# EAGLE schematic drive-sys-board (EAGLE 6.5.0)
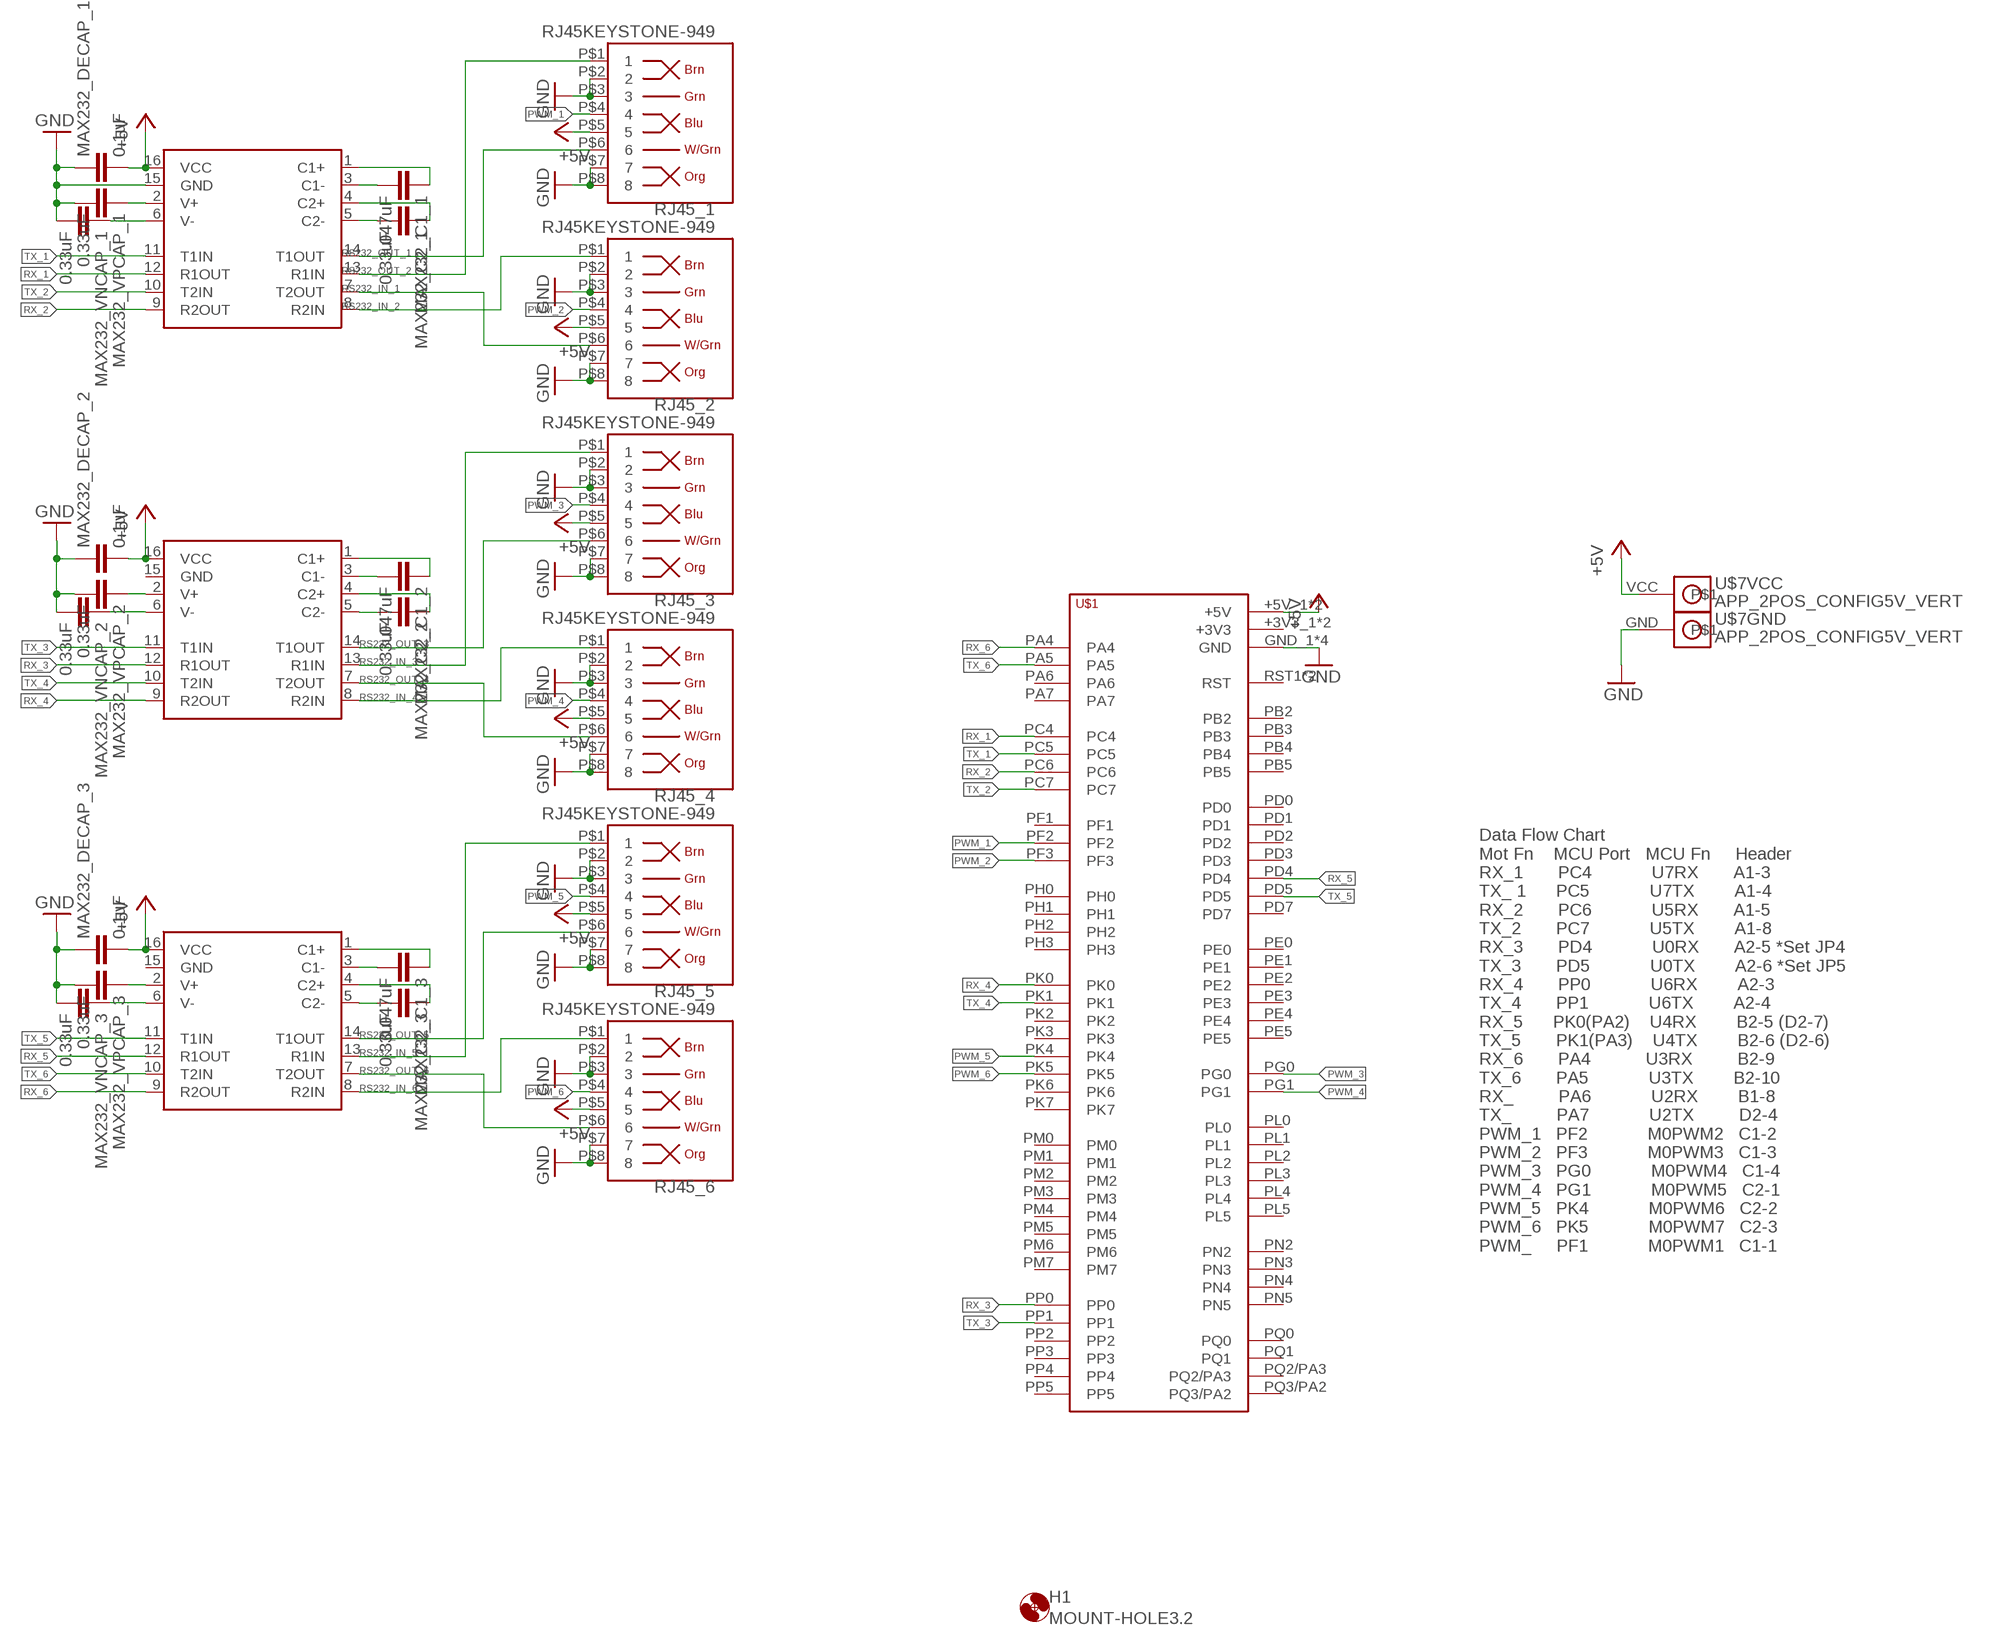
[diagram p0: schematic, sheet 1]

## Parts
H1  MOUNT-HOLE3.2  [3,2]
MAX232_1  MAX3232SO16  [SO16]
MAX232_2  MAX3232SO16  [SO16]
MAX232_3  MAX3232SO16  [SO16]
MAX232_C1_1  .047uF  CAP1206  [1206]
MAX232_C1_2  .047uF  CAP1206  [1206]
MAX232_C1_3  0.047uF  CAP1206  [1206]
MAX232_C2_1  0.33uF  CAP1206  [1206]
MAX232_C2_2  0.33uF  CAP1206  [1206]
MAX232_C2_3  0.33uF  CAP1206  [1206]
MAX232_DECAP_1  0.1uF  CAP1206  [1206]
MAX232_DECAP_2  0.1uF  CAP1206  [1206]
MAX232_DECAP_3  0.1uF  CAP1206  [1206]
MAX232_VNCAP_1  0.33uF  CAP1206  [1206]
MAX232_VNCAP_2  0.33uF  CAP1206  [1206]
MAX232_VNCAP_3  0.33uF  CAP1206  [1206]
MAX232_VPCAP_1  0.33uF  CAP1206  [1206]
MAX232_VPCAP_2  0.33uF  CAP1206  [1206]
MAX232_VPCAP_3  0.33uF  CAP1206  [1206]
RJ45_1  RJ45KEYSTONE-949  [KEYSTONE-949]
RJ45_2  RJ45KEYSTONE-949  [KEYSTONE-949]
RJ45_3  RJ45KEYSTONE-949  [KEYSTONE-949]
RJ45_4  RJ45KEYSTONE-949  [KEYSTONE-949]
RJ45_5  RJ45KEYSTONE-949  [KEYSTONE-949]
RJ45_6  RJ45KEYSTONE-949  [KEYSTONE-949]
U$1  TIVA-C-CONNECTED  [TIVA-C-CONNECTED]
U$7  APP_2POS_CONFIG5V_VERT  [APP45_5V_VERT_CONFIG]

## Nets
+5V: MAX232_1.16(VCC) MAX232_2.16(VCC) MAX232_3.16(VCC) MAX232_DECAP_1.2 MAX232_DECAP_2.2 MAX232_DECAP_3.2 RJ45_1.P$5 RJ45_2.P$5 RJ45_3.P$5 RJ45_4.P$5 RJ45_5.P$5 RJ45_6.P$5 U$1.+5V_1(+5V) U$1.+5V_2(+5V) U$7.VCC
GND: MAX232_1.15(GND) MAX232_DECAP_1.1 MAX232_DECAP_2.1 MAX232_DECAP_3.1 MAX232_VNCAP_1.2 MAX232_VNCAP_2.2 MAX232_VNCAP_3.2 MAX232_VPCAP_1.2 MAX232_VPCAP_2.2 MAX232_VPCAP_3.2 RJ45_1.P$2 RJ45_1.P$3 RJ45_1.P$7 RJ45_1.P$8 RJ45_2.P$2 RJ45_2.P$3 RJ45_2.P$7 RJ45_2.P$8 RJ45_3.P$2 RJ45_3.P$3 RJ45_3.P$7 RJ45_3.P$8 RJ45_4.P$2 RJ45_4.P$3 RJ45_4.P$7 RJ45_4.P$8 RJ45_5.P$2 RJ45_5.P$3 RJ45_5.P$7 RJ45_5.P$8 RJ45_6.P$2 RJ45_6.P$3 RJ45_6.P$7 RJ45_6.P$8 U$1.GND_1(GND) U$1.GND_2(GND) U$1.GND_3(GND) U$1.GND_4(GND) U$7.GND
N$1_1: MAX232_1.1(C1+) MAX232_C1_1.1
N$1_2: MAX232_2.1(C1+) MAX232_C1_2.1
N$1_3: MAX232_3.1(C1+) MAX232_C1_3.1
N$2_1: MAX232_1.2(V+) MAX232_VPCAP_1.1
N$2_2: MAX232_2.2(V+) MAX232_VPCAP_2.1
N$2_3: MAX232_3.2(V+) MAX232_VPCAP_3.1
N$3_1: MAX232_1.3(C1-) MAX232_C1_1.2
N$3_2: MAX232_2.3(C1-) MAX232_C1_2.2
N$3_3: MAX232_3.3(C1-) MAX232_C1_3.2
N$4_1: MAX232_1.4(C2+) MAX232_C2_1.1
N$4_2: MAX232_2.4(C2+) MAX232_C2_2.1
N$4_3: MAX232_3.4(C2+) MAX232_C2_3.1
N$5_1: MAX232_1.5(C2-) MAX232_C2_1.2
N$5_2: MAX232_2.5(C2-) MAX232_C2_2.2
N$5_3: MAX232_3.5(C2-) MAX232_C2_3.2
N$6_1: MAX232_1.6(V-) MAX232_VNCAP_1.1
N$6_2: MAX232_2.6(V-) MAX232_VNCAP_2.1
N$6_3: MAX232_3.6(V-) MAX232_VNCAP_3.1
PWM_1: RJ45_1.P$4 U$1.PF2
PWM_2: RJ45_2.P$4 U$1.PF3
PWM_3: RJ45_3.P$4 U$1.PG0
PWM_4: RJ45_4.P$4 U$1.PG1
PWM_5: RJ45_5.P$4 U$1.PK4
PWM_6: RJ45_6.P$4 U$1.PK5
RS232_IN_1: MAX232_1.13(R1IN) RJ45_1.P$1
RS232_IN_2: MAX232_1.8(R2IN) RJ45_2.P$1
RS232_IN_3: MAX232_2.13(R1IN) RJ45_3.P$1
RS232_IN_4: MAX232_2.8(R2IN) RJ45_4.P$1
RS232_IN_5: MAX232_3.13(R1IN) RJ45_5.P$1
RS232_IN_6: MAX232_3.8(R2IN) RJ45_6.P$1
RS232_OUT_1: MAX232_1.14(T1OUT) RJ45_1.P$6
RS232_OUT_2: MAX232_1.7(T2OUT) RJ45_2.P$6
RS232_OUT_3: MAX232_2.14(T1OUT) RJ45_3.P$6
RS232_OUT_4: MAX232_2.7(T2OUT) RJ45_4.P$6
RS232_OUT_5: MAX232_3.14(T1OUT) RJ45_5.P$6
RS232_OUT_6: MAX232_3.7(T2OUT) RJ45_6.P$6
RX_1: MAX232_1.12(R1OUT) U$1.PC4
RX_2: MAX232_1.9(R2OUT) U$1.PC6
RX_3: MAX232_2.12(R1OUT) U$1.PP0
RX_4: MAX232_2.9(R2OUT) U$1.PK0
RX_5: MAX232_3.12(R1OUT) U$1.PD4
RX_6: MAX232_3.9(R2OUT) U$1.PA4
TX_1: MAX232_1.11(T1IN) U$1.PC5
TX_2: MAX232_1.10(T2IN) U$1.PC7
TX_3: MAX232_2.11(T1IN) U$1.PP1
TX_4: MAX232_2.10(T2IN) U$1.PK1
TX_5: MAX232_3.11(T1IN) U$1.PD5
TX_6: MAX232_3.10(T2IN) U$1.PA5
Unconnected: MAX232_2.15(GND) MAX232_3.15(GND) U$1.+3V3_1(+3V3) U$1.+3V3_2(+3V3) U$1.PA6 U$1.PA7 U$1.PB2 U$1.PB3 U$1.PB4 U$1.PB5 U$1.PD0 U$1.PD1 U$1.PD2 U$1.PD3 U$1.PD7 U$1.PE0 U$1.PE1 U$1.PE2 U$1.PE3 U$1.PE4 U$1.PE5 U$1.PF1 U$1.PH0 U$1.PH1 U$1.PH2 U$1.PH3 U$1.PK2 U$1.PK3 U$1.PK6 U$1.PK7 U$1.PL0 U$1.PL1 U$1.PL2 U$1.PL3 U$1.PL4 U$1.PL5 U$1.PM0 U$1.PM1 U$1.PM2 U$1.PM3 U$1.PM4 U$1.PM5 U$1.PM6 U$1.PM7 U$1.PN2 U$1.PN3 U$1.PN4 U$1.PN5 U$1.PP2 U$1.PP3 U$1.PP4 U$1.PP5 U$1.PQ0 U$1.PQ1 U$1.PQ2/PA3 U$1.PQ3/PA2 U$1.RST1(RST) U$1.RST_2(RST)

## Notes on the sheet
- Data Flow Chart
  Mot Fn    MCU Port   MCU Fn     Header
  RX_1       PC4            U7RX       A1-3
  TX_ 1      PC5            U7TX        A1-4
  RX_2       PC6            U5RX       A1-5
  TX_2       PC7            U5TX        A1-8
  RX_3       PD4            U0RX       A2-5 *Set JP4
  TX_3       PD5            U0TX        A2-6 *Set JP5
  RX_4       PP0            U6RX        A2-3 
  TX_4       PP1            U6TX        A2-4
  RX_5      PK0(PA2)    U4RX        B2-5 (D2-7)
  TX_5       PK1(PA3)    U4TX        B2-6 (D2-6)
  RX_6       PA4           U3RX         B2-9
  TX_6       PA5            U3TX        B2-10
  RX_         PA6            U2RX        B1-8
  TX_         PA7            U2TX         D2-4
  PWM_1   PF2            M0PWM2   C1-2
  PWM_2   PF3            M0PWM3   C1-3
  PWM_3   PG0            M0PWM4   C1-4
  PWM_4   PG1            M0PWM5   C2-1
  PWM_5   PK4            M0PWM6   C2-2
  PWM_6   PK5            M0PWM7   C2-3
  PWM_     PF1            M0PWM1   C1-1

## Library data of the parts
H1 = holes:MOUNT-HOLE: MOUNTING HOLE with drill center marker
MAX232_1-MAX232_3 = MRDT-Digital-ICs:MAX3232: MAX3232 RS232 Transceiver http://pdfserv.maximintegrated.com/en/ds/MAX3222-MAX3241.pdf
MAX232_C1_1-MAX232_C1_3 MAX232_C2_1-MAX232_C2_3 MAX232_DECAP_1-MAX232_DECAP_3 MAX232_VNCAP_1-MAX232_VNCAP_3 MAX232_VPCAP_1-MAX232_VPCAP_3 = SparkFun-Capacitors:CAP: Capacitor Standard 0603 ceramic capacitor, and 0.1" leaded capacitor.
RJ45_1-RJ45_6 = MRDT-2015-General:RJ45
U$1 = MRDT-2015-General:TIVA-C-CONNECTED: TIVA C CONNECTED LAUNCHPAD
U$7 = MRDT-Connectors:APP_2POS_CONFIG; COLOR1: RED; COLOR2: BLACK